# Altium schematic sheet Sheet1.SchDoc
size A; SheetNumber: 1; SheetTotal: 1
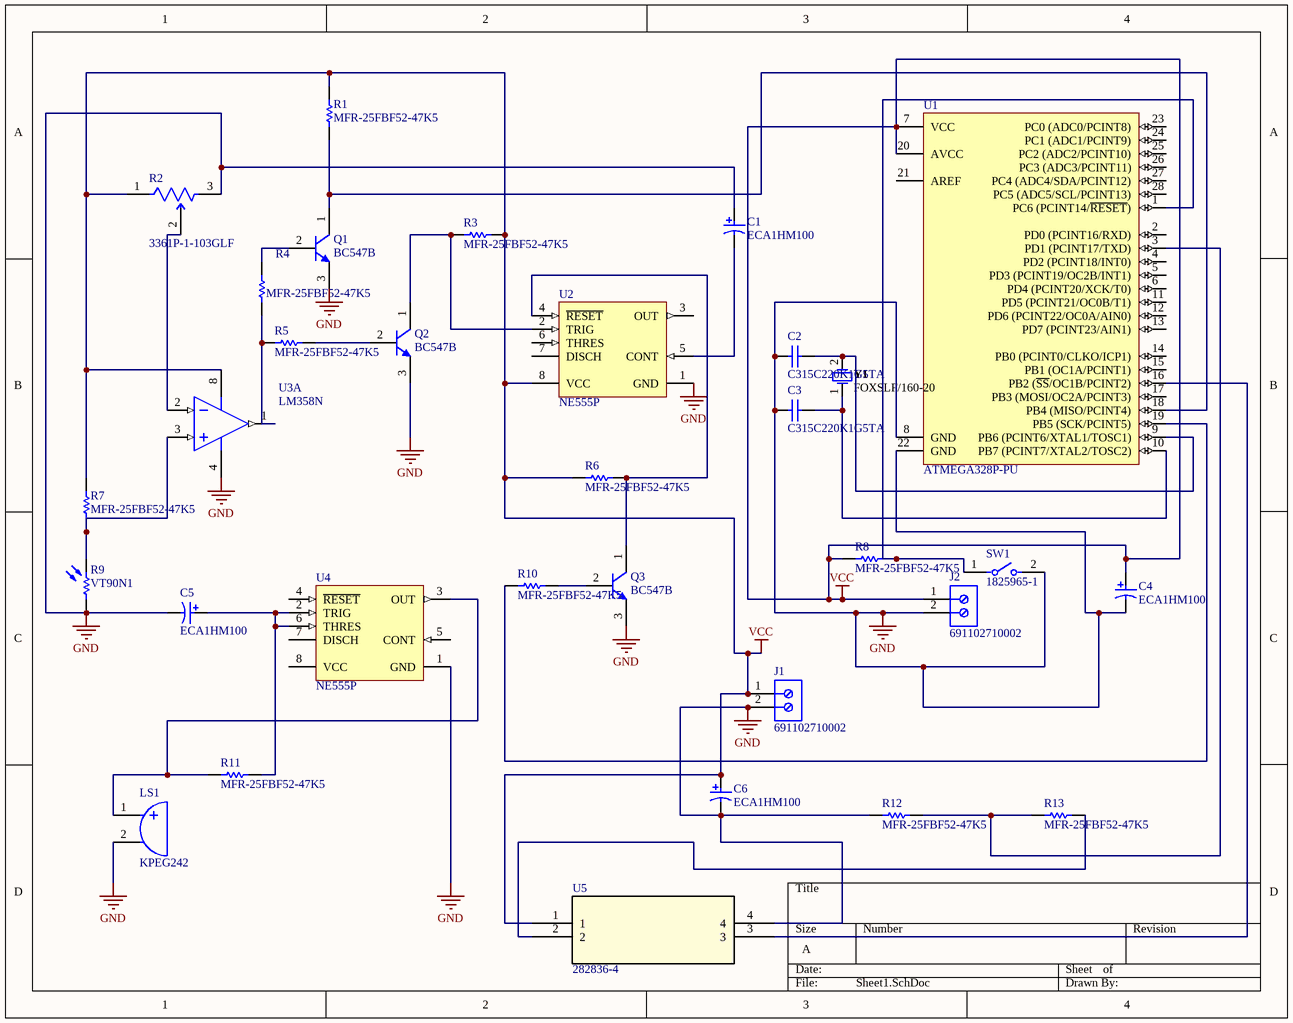
[diagram p0: Sheet1.SchDoc]

## Parts
C1  ECA1HM100  [CAPPR55-200-1100X500X1200]
C2  C315C220K1G5TA  [KEMT-C315-THT-2]
C3  C315C220K1G5TA  [KEMT-C315-THT-2]
C4  ECA1HM100  [CAPPR55-200-1100X500X1200]
C5  ECA1HM100  [CAPPR55-200-1100X500X1200]
C6  ECA1HM100  [CAPPR55-200-1100X500X1200]
J1  691102710002  [691102710002]
J2  691102710002  [691102710002]
LS1  KPEG242  [KINGS-KPEG242-2]
Q1  BC547B  [ONSC-TO-92-3-29-11]
Q2  BC547B  [ONSC-TO-92-3-29-11]
Q3  BC547B  [ONSC-TO-92-3-29-11]
R1  MFR-25FBF52-47K5  [RESA60-630X240]
R2  3361P-1-103GLF  [FP-3361P-MFG]
R3  MFR-25FBF52-47K5  [RESA60-630X240]
R4  MFR-25FBF52-47K5  [RESA60-630X240]
R5  MFR-25FBF52-47K5  [RESA60-630X240]
R6  MFR-25FBF52-47K5  [RESA60-630X240]
R7  MFR-25FBF52-47K5  [RESA60-630X240]
R8  MFR-25FBF52-47K5  [RESA60-630X240]
R9  VT90N1  [EXCE-VT90N1]
R10  MFR-25FBF52-47K5  [RESA60-630X240]
R11  MFR-25FBF52-47K5  [RESA60-630X240]
R12  MFR-25FBF52-47K5  [RESA60-630X240]
R13  MFR-25FBF52-47K5  [RESA60-630X240]
SW1  1825965-1  [FP-1825965-1-MFG]
U1  ATMEGA328P-PU  [ATML-28P3]
U2  NE555P  [P0008A]
U3  LM358N  [ONSC-PDIP-8-626-05_M]  (part A of 2)
U4  NE555P  [P0008A]
U5  282836-4  [282836-4_TYC]
Y1  FOXSLF/160-20  [FOX-FOXSLF160-20]

## Nets
GND: C1.1 C2.1 C3.1 C4.2 C5.2 C6.2 J1.2(GND) J2.2(GND) LS1.2 Q1.3(E) Q2.3(E) Q3.3(E) R2.3(CW) R9.1 R12.1 SW1.2 U1.8(GND) U1.22(GND) U2.1(GND) U3.4(VEE/GND) U4.1(GND) U5.4
VCC: C4.1 C6.1 J1.1(5V) J2.1(5V) R1.2 R2.1(CCW) R3.2 R6.1 R7.2 R8.1 U1.7(VCC) U1.20(AVCC) U2.8(VCC) U3.8(VCC) U5.1
NetC1_2: C1.2 U2.5(CONT)
NetC2_2: C2.2 U1.9(PB6_(PCINT6/XTAL1/TOSC1)) Y1.2
NetC3_2: C3.2 U1.10(PB7_(PCINT7/XTAL2/TOSC2)) Y1.1
NetC5_1: C5.1 R11.2 U4.2(TRIG) U4.6(THRES)
NetLS1_1: LS1.1 R11.1 U4.3(OUT)
NetQ1_1: Q1.1(C) R1.1 U1.18(PB4_(MISO/PCINT4))
NetQ1_2: Q1.2(B) R4.2
NetQ2_1: Q2.1(C) R3.1 U2.2(TRIG)
NetQ2_2: Q2.2(B) R5.2
NetQ3_1: Q3.1(C) R6.2 U2.4(~{RESET})
NetQ3_2: Q3.2(B) R10.2
NetR2_2: R2.2(WIPER) U3.2(INA-)
NetR4_1: R4.1 R5.1 U3.1(OUTA)
NetR7_1: R7.1 R9.2 U3.3(INA+)
NetR8_2: R8.2 SW1.1 U1.1(PC6_(PCINT14/~{RESET}))
NetR10_1: R10.1 U1.19(PB5_(SCK/PCINT5))
NetR12_2: R12.2 R13.1 U1.3(PD1_(PCINT17/TXD))
NetR13_2: R13.2 U5.2
NetU1_16: U1.16(PB2_(~{SS}/OC1B/PCINT2)) U5.3

Not connected (* = marked no-connect by the designer): U1 2(PD0_(PCINT16/RXD)) 4(PD2_(PCINT18/INT0)) 5(PD3_(PCINT19/OC2B/INT1)) 6(PD4_(PCINT20/XCK/T0)) 11(PD5_(PCINT21/OC0B/T1)) 12(PD6_(PCINT22/OC0A/AIN0)) 13(PD7_(PCINT23/AIN1)) 14(PB0_(PCINT0/CLKO/ICP1)) 15(PB1_(OC1A/PCINT1)) 17(PB3_(MOSI/OC2A/PCINT3)) 21(AREF) 23(PC0_(ADC0/PCINT8)) 24(PC1_(ADC1/PCINT9)) 25(PC2_(ADC2/PCINT10)) 26(PC3_(ADC3/PCINT11)) 27(PC4_(ADC4/SDA/PCINT12)) 28(PC5_(ADC5/SCL/PCINT13)); U2 3(OUT) 6(THRES) 7(DISCH); U4 4(~{RESET}) 5(CONT) 7(DISCH) 8(VCC)

## Library data of the parts
C1 C4-C6 = CMP-1665-00038-2: Aluminum Electrolytic Capacitor, 10 uF, +/- 20%, 50 V, -40 to 85 degC, 2-Pin THD, RoHS, Bulk; Manufacturer: Panasonic; Life (Hours): 2000Hour; Lead/Base Style: Straight; Dissipation Factor: 0.12%; Capacitance: 10uF; Leakage Current: 3uA; Dielectric Material: Aluminium; Lead Diameter: 0.5mm; Voltage Rating: 50V; Ripple Current: 65mA; Package Reference: CAPPR55-200-1100X500X1200; Height: 11mm; Diameter: 5mm; REACH SVHC: NoSVHC; Mount: ThroughHole; Packaging: Bulk; Manufacturer URL: http://www.panasonic.com/; Termination: Radial; Datasheet URL: https://industrial.panasonic.com/cdbs/www-data/pdf/RDF0000/ABA0000C1218.pdf; Lead Free: LeadFree; Height - Seated (Max): 0.472inch; Case/Package: Radial; Package Description: 2-Pin Radial Lead, Dia 5 mm, Height 12 mm; Tolerance: 20%; Datasheet Version: Rev. 05, 10/2016; Package Quantity: 200; Ripple Current (AC): 65mA; Min Operating Temperature: -40degC; RoHSCompliant: true; Number of Pins: 2; Max Operating Temperature: 85degC; Voltage: 50V; Lead Pitch: 2mm; Radiation Hardening: No; Voltage Rating (DC): 50V; Length: 11mm
C2 C3 = CMP-1664-00008-1: Capacitor, Ceramic, 22 pF, +/-10 %, 100 V, -55 to 125 degC, 2-Pin THD, RoHS, Bulk; Max Input Voltage: 40 V; Min Input Voltage: 4.2 V; Output Current: 1.5 A; Output Voltage: 1.2 V; Outputs: 1; Case\Package: TO-220; RoHSCompliant: true; Min Operating Temperature: 0 degC; Max Operating Temperature: 125 degC; Package Quantity: 50; ComponentLink2URL: http://capacitoredge.kemet.com/capedge2/DataSheet/Datasheet-C315C220K1G5TA.pdf?pn=C315C220K1G5TA{BULK}; Radiation Hardening: No; Pins: 3; Length: 10.28 mm; ComponentLink1URL: http://www.kemet.com/; ComponentLink2Description: Datasheet; Height: 9.28 mm; REACH SVHC: No SVHC; ComponentLink1Description: Manufacturer URL; Max Ouput Current: 1.5 A; Weight: 0.08113 oz; Packaging: Rail/Tube; DatasheetVersion: Aug-16; Mount: Through Hole; PackageReference: C315-THT-2; Width: 4.82 mm; PackageDescription: 2-Pin Through Hole Device, Body 3.81 x 2.54 mm
J1 J2 = CMP-1502-03258-1: Series 102 - 5.00 mm Horizontal Entry Modular with Pressure Clamp WR-TBL, 2 pin; Manufacturer: Wurth Elektronik; Pin Number: 2; Pitch: 5.00mm; Manufacturer URL: http://www.we-online.de; Mounting Technology: THT; Publisher: WurthElektronik; Packaging: Box; Package Reference: 691102710002; Datasheet URL: http://katalog.we-online.de/em/datasheet/6911027100xx.pdf; Operating Temperature: -40to105degC; Part Number: 691102710002
LS1 = CMP-2000-06518-1: Piezo Indicator, 4100 Hz, 3 to 16 V, -20 to 70 degC, 2-Pin THD, RoHS; PartNumber: KPE-242; Manufacturer: KingstateElectronicsCorp.; Frequency Range: 3600to4600Hz; Maximum Supply Current: 7mA; Typical Operating Supply Voltage: 12Vdc; Product Height: 7.6mm; Current - Max: 7A; Tone Mode: Continuous; Product Diameter: 13.7mm; Minimum Sound Pressure: 70dBA; Maximum Resonant Frequency: 4600Hz; Type: Indicator; Datasheet URL: https://datasheet.ciiva.com/11776/0900766b8068f3a2-11776713.pdf; Mounting: ThroughHole; Technology: Piezo; Operating Temperature: -20to70°C; Category: AudioIndicatorsandAlerts; Termination Method: Pin; Manufacturer URL: http://www.kingstate.com.tw/index.php/en/; Package Description: 2-Pin Through Hole Device, Body Dia 13.7 mm, Pitch 7.62 mm; Datasheet Version: 01/2006; Package Reference: KPEG242; Mounting Technology: ThroughHole
Q1-Q3 = CMP-1048-01467-1: Amplifier Transistor, NPN Silicon, 3-Pin TO-92, Bulk Box; Manufacturer: On Semiconductor; IC Continuous (A): 0.1; fT Min (MHz): 150; DatasheetVersion: Rev. 7; ComponentLink1URL: http://www.onsemi.com/; Polarity: NPN; RoHS: FALSE; ComponentLink1Description: Manufacturer URL; Packing: Bulk Box; PackageDescription: 3-Pin Transistor Outline, Body 4.825 x 3.685 mm, Pitch 1.27 mm; ComponentLink3URL: http://www.onsemi.cn/pub_link/Collateral/2N6426-D.PDF; ComponentLink2Description: Datasheet; PackageVersion: Rev. AM; PackageReference: TO-92-3-29-11_AM_SL; ComponentLink3Description: Package Specification; Mounting Technology: Through Hole; PartNumber: BC547B; ComponentLink2URL: http://www.onsemi.com/pub_link/Collateral/BC546-D.PDF
R1 R3-R8 R10-R13 = CMP-1659-00063-1: Axial Resistor, 47.5 KOhm, +/- 1%, 0.25 W, -55 to 155 degC, 2-Pin THD, RoHS, Bulk; Tolerance: 20%; Shielding: Shielded; Current Rating: 1.3 A; Case\Package: 1008; ComponentLink1Description: Manufacturer URL; Packaging: Tape and Reel; ComponentLink2Description: Datasheet; Radiation Hardening: No; ComponentLink2URL: http://www.yageo.com/documents/recent/Yageo%20LR_MFR_2013.pdf; Min Operating Temperature: -55 degC; Mount: Surface Mount; Width: 2 mm; Length: 2.5 mm; Max Operating Temperature: 125 degC; PackageReference: MFR-25; Height: 1.2 mm; ComponentLink1URL: http://www.yageo.com/; DatasheetVersion: Apr-13; RoHSCompliant: true; Package Quantity: 3000; Case Code (Metric): 2520; PackageDescription: 2-Pin Axial Lead, Dia 2.4 mm, Body Length 6.3 mm
R2 = CMP-07234-000045-1: TRIMMER 10K OHM 0.5W GW TOP ADJ; Power Rating: 500mW; Temperature Coefficient: 100ppm/°C; Tolerance: 10%; Voltage Rating (DC): 300V; Resistance: 10kR; Number of Turns: 1; RoHS Compliant: Yes; Technology: CERMET; Packaging: Tape and Reel; Width: 0.264inch; Weight: 0.567g; Max Operating Temperature: 125°C; REACH SVHC: No SVHC; Series: Trimpot® 3361 - Sealed; Lead Free: Lead Free; Depth: 8.53mm; Taper: Linear; Package Quantity: 1; Min Operating Temperature: -55°C; Termination: Gull Wing; Radiation Hardening: No; Height: 0.205inch; Contact Plating: Tin; Voltage Rating: 300V; Length: 6.71mm; Max Power Dissipation: 500mW; Mount: Surface Mount; Military Standard: Not; Color: Natural; Resistor Type: Cermet; Resistance Tolerance: 10%
R9 = CMP-2000-07406-1: Photoconductive Resistor, 200 kOhm, 100 V, 80 mW, -40 to 75 degC, 2-Pin THD, RoHS; Manufacturer: Excelitas Technology; SVHC: Cadmiumchloride(15-Jun-2015); Power Rating: 80mW; Resistance @ Lux: 12kohm; Voltage Rating: 100V; Product Range: -; Datasheet Version: 09/2006; Resistor Case Style: -; Operating Temperature Max: 75°C; Package Reference: VT90N1; Datasheet URL: http://datasheet.octopart.com/VT90N1-Excelitas-datasheet-10388451.pdf; Mounting Technology: ThroughHole; Operating Temperature Min: -40°C; Dark Resistance: 200kohm; Package Description: 2-Pin Through Hole Device, Body Width 4.17 mm (Max), Height 2.29 mm; Manufacturer URL: http://www.excelitas.com/Pages/Index.aspx; Packaging: Each
SW1 = CMP-03407-000024-1: SWITCH TACTILE SPST-NO 0.05A 24V; Mechanical Life: 100000Cycles; Switch Travel: 0.25mm; Contact Current Rating: 50mA; Actuator Length: 1.52mm; Operating Force: 1.3N; Switch Function: Off-Mom; Contact Resistance: 100mR; Illumination Type: Non-Illuminated; Throw Configuration: SPST; Actuator Material: PBT; Electrical Life: 20000Cycles; Series: FSM, Alcoswitch; Termination: PC Pins; Package Quantity: 1000; Lead Free: Lead Free; Packaging: Loose Piece; Max Operating Temperature: 105°C; Max Voltage Rating (DC): 24V; Max Current Rating: 50mA; Contact Plating: Silver; Length: 3.5mm; Depth: 6.5mm; RoHS Compliant: Yes; ELV: Compliant; Mount: Through Hole; Min Operating Temperature: -35°C; Contact Material: Copper Alloy; Orientation: Straight; Voltage Rating (DC): 24V; Type: Switch
U1 = CMP-020-00004-3: 8-Bit Microcontroller with 32 KBytes In-System Programmable Flash, 23 I/Os, -40 to 85 degC, 28-Pin PDIP (28P3), RoHS, Tube; Manufacturer: Atmel; I/Os: 23; Density: 32KB; Package Version: Rev. B, 09/2001; Max Clock Frequency: 20MHz; Interface: USART; Max Supply Voltage: 5.5V; Min Supply Voltage: 1.8V; Ethernet Channels: 0; RAM Size: 2KB; RoHS Compliant: True; Datasheet URL: http://www.atmel.com/images/Atmel-8271-8-bit-AVR-Microcontroller-ATmega48A-48PA-88A-88PA-168A-168PA-328-328P_datasheet_Complete.pdf; Packaging: Rail/Tube; Manufacturer URL: http://www.atmel.com/; Mounting Technology: TH; Package URL: http://www.atmel.com/images/Atmel-8271-8-bit-AVR-Microcontroller-ATmega48A-48PA-88A-88PA-168A-168PA-328-328P_datasheet_Complete.pdf; Datasheet Version: Rev. 8271J, 11/2015; Package Description: 28-Pin Plastic Dual Inline Package, Body 34.671 x 7.3025 mm, Pitch 2.54 mm; Package Quantity: 14; Min Operating Temperature: -40°C; Max Operating Temperature: 85°C; Case/Package: DIP; Pins: 28; Package Reference: 28P3
U2 U4 = CMP-2000-04954-1: Precision Timer, 4.5 to 16 V, 0 to 70 degC, 8-Pin DIP, Pb-Free, Tube; Manufacturer: TexasInstruments; Maximum High Level Output Current: -200mA; Number of Internal Timers: 1; Operating Supply Voltage: 5; Maximum Low Level Output Current: 200mA; Rad Hard: No; Packaging: Rail/Tube; Manufacturer URL: http://www.ti.com/; Package Reference: P8; Package Description: 8-Pin Double In-line Package, Body 9.59 x 6.35 mm, Pitch 2.54 mm; Package URL: http://www.ti.com/lit/ml/mpdi001b/mpdi001b.pdf; Type: Standard; Datasheet URL: http://www.ti.com/general/docs/lit/getliterature.tsp?genericPartNumber=NE555&fileType=pdf; Category: Timer; Package: 8PDIP; Datasheet Version: Rev. I, 09/2014
U3 = CMP-1310-00098-1: Single Supply Dual Operational Amplifier, 3 to 32 V, 0 to 70 degC, 8-Pin PDIP, Tube; Manufacturer: On Semiconductor; VCC Max (V): 32; VCC Min (V): 3; Mounting Technology: Through Hole; ComponentLink3Description: Package Specification; ComponentLink3URL: http://www.onsemi.com/pub_link/Collateral/LM211-D.PDF; RoHS: FALSE; Packing: Tube; PackageDescription: 8-Pin Plastic Dual-In Line Package, Body 9.52 x 6.605 mm, Pitch 2.54 mm; PackageReference: PDIP-8-626-05; PackageVersion: Rev. M, 04/2010; PartNumber: LM358N; ComponentLink2Description: Datasheet; ComponentLink2URL: http://www.onsemi.cn/pub_link/Collateral/LM358-D.PDF; ComponentLink1URL: http://www.onsemi.com/; ComponentLink1Description: Manufacturer URL; DatasheetVersion: Rev. 27
U5 = 282836-4: No Description Available; Mfr_Name: TE Connectivity; RefDes: RefDes; Type: Type
Y1 = CMP-1749-00003-1: Resistance Weld Thru-Hole Crystal, 16 MHz, -20 to 70 degC, 2-Pin THD, RoHS, Bulk; Voltage Rating: 250 V; Tolerance: 1%; Resistance: 221 kohm; Case\Package: Axial; Power Rating: 250 mW; RoHSCompliant: true; Package Quantity: 200; Packaging: Bulk; Min Operating Temperature: -55 degC; DatasheetVersion: Mar-15; ComponentLink1URL: http://www.foxonline.com/; Max Operating Temperature: 155 degC; PackageReference: FOXSLF160-20; Mount: Through Hole; PackageDescription: 2-Pin Through Hole Device, Body 11.35 x 4.65 mm; ComponentLink1Description: Manufacturer URL; ComponentLink2URL: http://www.foxonline.com/pdfs/hc49slf.pdf; ComponentLink2Description: Datasheet; Length: 0.248 inch